# Altium schematic sheet steering-wheel.SchDoc
size A
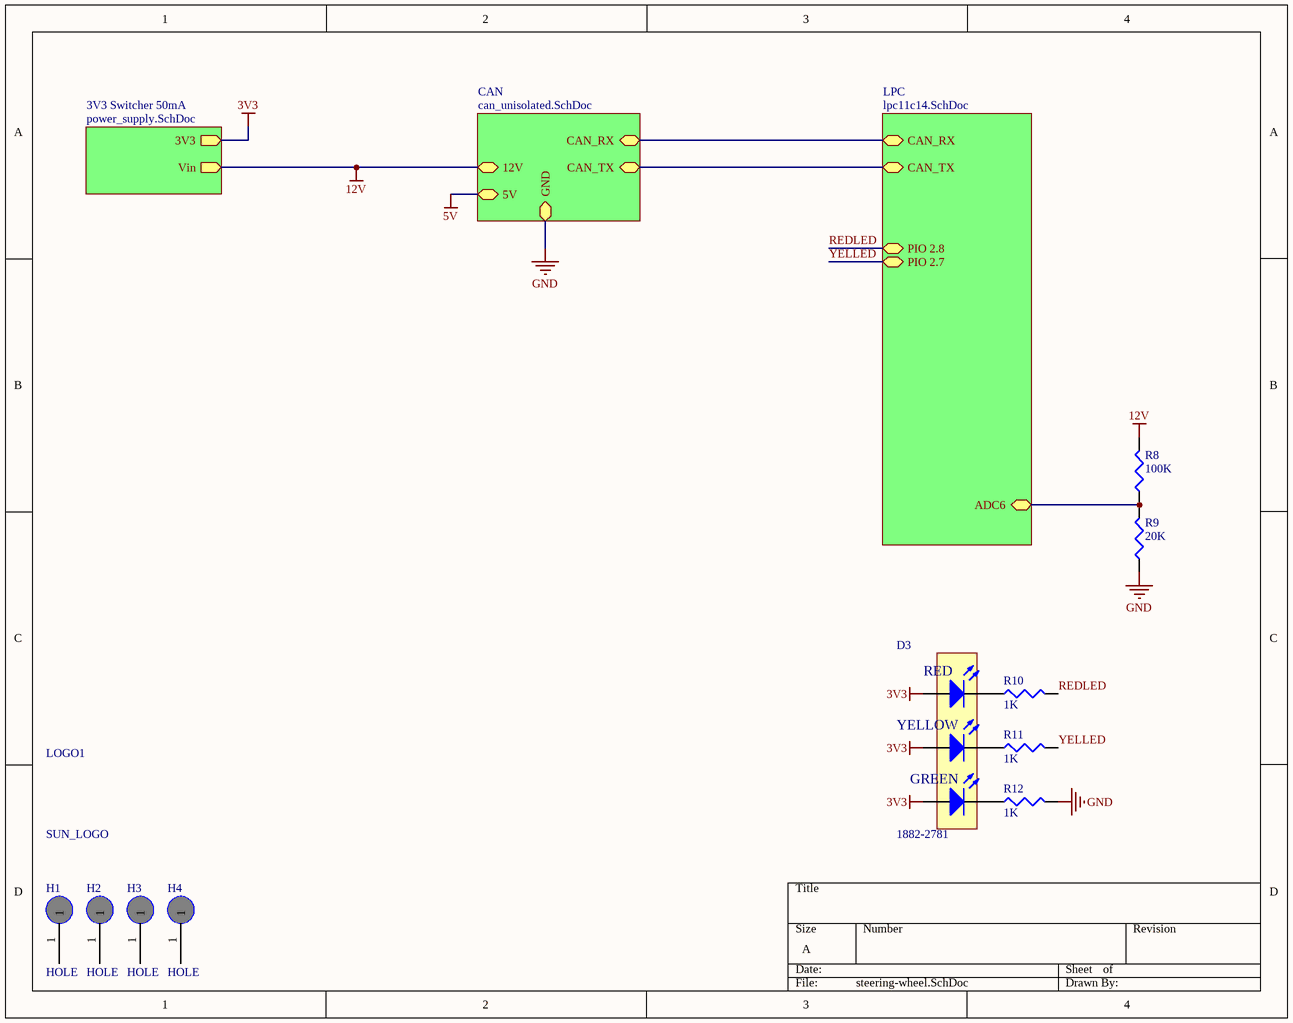
[diagram p0: steering-wheel.SchDoc]

## Parts
D3  1882-2781  [LED_TRILEVEL]
H1  HOLE  [M2.5]
H2  HOLE  [M2.5]
H3  HOLE  [M2.5]
H4  HOLE  [M2.5]
LOGO1  SUN_LOGO  [SUNSWIFTLOGO]
R8  100K  [0603]
R9  20K  [0603]
R10  1K  [0603]
R11  1K  [0603]
R12  1K  [0603]

## Sub-sheets
3V3 Switcher 50mA = power_supply.SchDoc: 3V3, Vin
CAN = can_unisolated.SchDoc: CAN_RX (bidir), CAN_TX (bidir), 12V, GND (bidir), 5V
LPC = lpc11c14.SchDoc: CAN_RX (bidir), CAN_TX (bidir), ADC6 (bidir), PIO 2.8 (bidir), PIO 2.7 (bidir)

## Nets
3V3: D3.4(A) D3.5(A) D3.6(A) ; sheet 3V3 Switcher 50mA/3V3
5V: sheet CAN/5V
12V: R8.2 ; sheet CAN/12V, sheet 3V3 Switcher 50mA/Vin
GND: R9.1 R12.2 ; sheet CAN/GND
REDLED: R10.2 ; sheet LPC/PIO 2.8
YELLED: R11.2 ; sheet LPC/PIO 2.7
NetD3_1: D3.1(K) R12.1
NetD3_2: D3.2(K) R11.1
NetD3_3: D3.3(K) R10.1
NetR8_1: R8.1 R9.2 ; sheet LPC/ADC6
(unnamed): sheet LPC/CAN_RX, sheet CAN/CAN_RX
(unnamed): sheet LPC/CAN_TX, sheet CAN/CAN_TX

Not connected (* = marked no-connect by the designer): H1 1; H2 1; H3 1; H4 1

## Notes on the sheet
- (in symbol LED-TRILEVEL) RED; YELLOW; GREEN

## Library data of the parts
D3 = LED-TRILEVEL: Three level LED; Needed?: Farnell - Low Stock; Farnell: 1461596; Farnell Price: 4.56
H1-H4 = HOLE: Needed?: NO - Footprint
R8-R12 = RES1: Resistor; Needed?: NO - HW LAB
  R8: Value: 100k
  R9: Value: 20k
  R10-R12: Value: 1k